# EAGLE design Display (EAGLE 7.1.0)
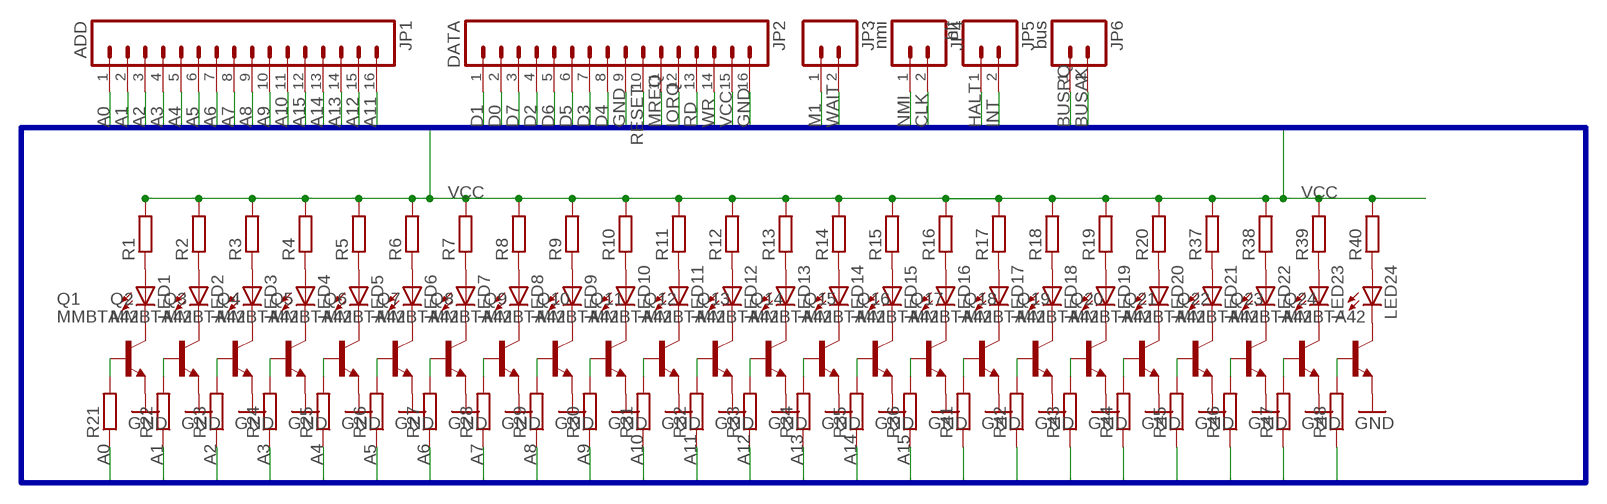
[diagram p0: schematic, sheet 1]

## Parts
JP1  ADD  M16PTH  [1X16]
JP2  DATA  M16PTH  [1X16]
JP3  M02PTH  [1X02]
JP4  nmi  M02PTH  [1X02]
JP5  hlt  M02PTH  [1X02]
JP6  bus  M02PTH  [1X02]
LED1  LEDCHIP-LED0805  [CHIP-LED0805]
LED2  LEDCHIP-LED0805  [CHIP-LED0805]
LED3  LEDCHIP-LED0805  [CHIP-LED0805]
LED4  LEDCHIP-LED0805  [CHIP-LED0805]
LED5  LEDCHIP-LED0805  [CHIP-LED0805]
LED6  LEDCHIP-LED0805  [CHIP-LED0805]
LED7  LEDCHIP-LED0805  [CHIP-LED0805]
LED8  LEDCHIP-LED0805  [CHIP-LED0805]
LED9  LEDCHIP-LED0805  [CHIP-LED0805]
LED10  LEDCHIP-LED0805  [CHIP-LED0805]
LED11  LEDCHIP-LED0805  [CHIP-LED0805]
LED12  LEDCHIP-LED0805  [CHIP-LED0805]
LED13  LEDCHIP-LED0805  [CHIP-LED0805]
LED14  LEDCHIP-LED0805  [CHIP-LED0805]
LED15  LEDCHIP-LED0805  [CHIP-LED0805]
LED16  LEDCHIP-LED0805  [CHIP-LED0805]
LED17  LEDCHIP-LED0805  [CHIP-LED0805]
LED18  LEDCHIP-LED0805  [CHIP-LED0805]
LED19  LEDCHIP-LED0805  [CHIP-LED0805]
LED20  LEDCHIP-LED0805  [CHIP-LED0805]
LED21  LEDCHIP-LED0805  [CHIP-LED0805]
LED22  LEDCHIP-LED0805  [CHIP-LED0805]
LED23  LEDCHIP-LED0805  [CHIP-LED0805]
LED24  LEDCHIP-LED0805  [CHIP-LED0805]
Q1  MMBTA42  [SOT23]
Q2  MMBTA42  [SOT23]
Q3  MMBTA42  [SOT23]
Q4  MMBTA42  [SOT23]
Q5  MMBTA42  [SOT23]
Q6  MMBTA42  [SOT23]
Q7  MMBTA42  [SOT23]
Q8  MMBTA42  [SOT23]
Q9  MMBTA42  [SOT23]
Q10  MMBTA42  [SOT23]
Q11  MMBTA42  [SOT23]
Q12  MMBTA42  [SOT23]
Q13  MMBTA42  [SOT23]
Q14  MMBTA42  [SOT23]
Q15  MMBTA42  [SOT23]
Q16  MMBTA42  [SOT23]
Q17  MMBTA42  [SOT23]
Q18  MMBTA42  [SOT23]
Q19  MMBTA42  [SOT23]
Q20  MMBTA42  [SOT23]
Q21  MMBTA42  [SOT23]
Q22  MMBTA42  [SOT23]
Q23  MMBTA42  [SOT23]
Q24  MMBTA42  [SOT23]
R1  R-EU_M0805  [M0805]
R2  R-EU_M0805  [M0805]
R3  R-EU_M0805  [M0805]
R4  R-EU_M0805  [M0805]
R5  R-EU_M0805  [M0805]
R6  R-EU_M0805  [M0805]
R7  R-EU_M0805  [M0805]
R8  R-EU_M0805  [M0805]
R9  R-EU_M0805  [M0805]
R10  R-EU_M0805  [M0805]
R11  R-EU_M0805  [M0805]
R12  R-EU_M0805  [M0805]
R13  R-EU_M0805  [M0805]
R14  R-EU_M0805  [M0805]
R15  R-EU_M0805  [M0805]
R16  R-EU_M0805  [M0805]
R17  R-EU_M0805  [M0805]
R18  R-EU_M0805  [M0805]
R19  R-EU_M0805  [M0805]
R20  R-EU_M0805  [M0805]
R21  R-EU_M0805  [M0805]
R22  R-EU_M0805  [M0805]
R23  R-EU_M0805  [M0805]
R24  R-EU_M0805  [M0805]
R25  R-EU_M0805  [M0805]
R26  R-EU_M0805  [M0805]
R27  R-EU_M0805  [M0805]
R28  R-EU_M0805  [M0805]
R29  R-EU_M0805  [M0805]
R30  R-EU_M0805  [M0805]
R31  R-EU_M0805  [M0805]
R32  R-EU_M0805  [M0805]
R33  R-EU_M0805  [M0805]
R34  R-EU_M0805  [M0805]
R35  R-EU_M0805  [M0805]
R36  R-EU_M0805  [M0805]
R37  R-EU_M0805  [M0805]
R38  R-EU_M0805  [M0805]
R39  R-EU_M0805  [M0805]
R40  R-EU_M0805  [M0805]
R41  R-EU_M0805  [M0805]
R42  R-EU_M0805  [M0805]
R43  R-EU_M0805  [M0805]
R44  R-EU_M0805  [M0805]
R45  R-EU_M0805  [M0805]
R46  R-EU_M0805  [M0805]
R47  R-EU_M0805  [M0805]
R48  R-EU_M0805  [M0805]

## Nets
A0: JP1.1 R21.1
A1: JP1.2 R22.1
A2: JP1.3 R23.1
A3: JP1.4 R24.1
A4: JP1.5 R25.1
A5: JP1.6 R26.1
A6: JP1.7 R27.1
A7: JP1.8 R28.1
A8: JP1.9 R29.1
A9: JP1.10 R30.1
A10: JP1.11 R31.1
A11: JP1.16 R32.1
A12: JP1.15 R33.1
A13: JP1.14 R34.1
A14: JP1.13 R35.1
A15: JP1.12 R36.1
BUSAK: JP6.2
BUSRQ: JP6.1
CLK: JP4.2
D0: JP2.2 R41.1
D1: JP2.1 R42.1
D2: JP2.4 R43.1
D3: JP2.7 R44.1
D4: JP2.8 R45.1
D5: JP2.6 R46.1
D6: JP2.5 R47.1
D7: JP2.3 R48.1
GND: JP2.9 JP2.16 Q1.2(E) Q2.2(E) Q3.2(E) Q4.2(E) Q5.2(E) Q6.2(E) Q7.2(E) Q8.2(E) Q9.2(E) Q10.2(E) Q11.2(E) Q12.2(E) Q13.2(E) Q14.2(E) Q15.2(E) Q16.2(E) Q17.2(E) Q18.2(E) Q19.2(E) Q20.2(E) Q21.2(E) Q22.2(E) Q23.2(E) Q24.2(E)
HALT: JP5.1
INT: JP5.2
IORQ: JP2.12
M1: JP3.1
MREQ: JP2.11
N$1: LED1.A R1.1
N$2: LED1.C Q1.3(C)
N$3: LED2.A R2.1
N$4: LED2.C Q2.3(C)
N$5: LED3.A R3.1
N$6: LED3.C Q3.3(C)
N$7: LED4.A R4.1
N$8: LED4.C Q4.3(C)
N$9: LED5.A R5.1
N$10: LED5.C Q5.3(C)
N$11: LED6.A R6.1
N$12: LED6.C Q6.3(C)
N$13: LED7.A R7.1
N$14: LED7.C Q7.3(C)
N$15: LED8.A R8.1
N$16: LED8.C Q8.3(C)
N$17: LED9.A R9.1
N$18: LED9.C Q9.3(C)
N$19: LED10.A R10.1
N$20: LED10.C Q10.3(C)
N$21: LED11.A R11.1
N$22: LED11.C Q11.3(C)
N$23: LED12.A R12.1
N$24: LED12.C Q12.3(C)
N$25: LED13.A R13.1
N$26: LED13.C Q13.3(C)
N$27: LED14.A R14.1
N$28: LED14.C Q14.3(C)
N$29: LED15.A R15.1
N$30: LED15.C Q15.3(C)
N$31: LED16.A R16.1
N$32: LED16.C Q16.3(C)
N$33: Q24.1(B) R48.2
N$34: Q23.1(B) R47.2
N$35: Q22.1(B) R46.2
N$36: Q21.1(B) R45.2
N$37: Q20.1(B) R44.2
N$38: Q19.1(B) R43.2
N$39: Q18.1(B) R42.2
N$40: Q17.1(B) R41.2
N$41: LED17.A R17.1
N$42: LED17.C Q17.3(C)
N$43: LED18.A R18.1
N$44: LED18.C Q18.3(C)
N$45: Q16.1(B) R36.2
N$46: Q15.1(B) R35.2
N$47: Q14.1(B) R34.2
N$48: Q13.1(B) R33.2
N$49: Q12.1(B) R32.2
N$50: Q11.1(B) R31.2
N$51: Q10.1(B) R30.2
N$52: Q9.1(B) R29.2
N$53: Q8.1(B) R28.2
N$54: Q7.1(B) R27.2
N$55: Q6.1(B) R26.2
N$56: Q5.1(B) R25.2
N$57: Q4.1(B) R24.2
N$58: Q3.1(B) R23.2
N$59: Q2.1(B) R22.2
N$60: Q1.1(B) R21.2
N$61: LED19.A R19.1
N$62: LED19.C Q19.3(C)
N$63: LED20.A R20.1
N$64: LED20.C Q20.3(C)
N$65: LED21.A R37.1
N$66: LED21.C Q21.3(C)
N$67: LED22.A R38.1
N$68: LED22.C Q22.3(C)
N$69: LED23.A R39.1
N$70: LED23.C Q23.3(C)
N$71: LED24.A R40.1
N$72: LED24.C Q24.3(C)
NMI: JP4.1
RD: JP2.13
RESET: JP2.10
VCC: JP2.15 R1.2 R2.2 R3.2 R4.2 R5.2 R6.2 R7.2 R8.2 R9.2 R10.2 R11.2 R12.2 R13.2 R14.2 R15.2 R16.2 R17.2 R18.2 R19.2 R20.2 R37.2 R38.2 R39.2 R40.2
WAIT: JP3.2
WR: JP2.14

## Buses
A0,A1,A2,A3,A4,A5,A6,A7,A8,A9,A10,A11,A12,A13,A14,A15,D0,D1,D2,D3,D4,D5,D6,D7,GND,VCC,WR,RD,IORQ,MREQ,RESET,M1,CLK,WAIT,NMI,HALT,INT,BUSRQ,BUSAK

## Library data of the parts
JP1 JP2 = SparkFun-Connectors:M16: 1x16 .1" header
JP3-JP6 = SparkFun:M02: Header 2 Standard 2-pin 0.1" header. Use with straight break away headers (SKU : PRT-00116), right angle break away headers (PRT-00553), swiss pins (PRT-00743), machine pins (PRT-00117), and female headers (PRT-00115). Molex polarized connector foot print use with SKU : PRT-08233 with associated crimp pins and housings.
LED1-LED24 = adafruit:LED: LED OSRAM: - CHIPLED LG R971, LG N971, LY N971, LG Q971, LY Q971, LO R971, LY R971 LH N974, LH R974 LS Q976, LO Q976, LY Q976 LO Q996 - Hyper CHIPLED LW Q18S LB Q993, LB Q99A, LB R99A - SideLED LS A670, LO A670, LY A670, LG A670, LP A670 LB A673, LV A673, LT A673, LW A673 LH A674 LY A675 LS A676, LA A676, LO A676, LY A676, LW A676 LS A679, LY A679, LG A679 - Hyper Micro SIDELED® LS Y876, LA Y876, LO Y876, LY Y876 LT Y87S - SmartLED LW L88C, LW L88S LB L89C, LB L89S, LG L890 LS L89K, LO L89K, LY L89K LS L896, LA L896, LO L896, LY L896 - TOPLED LS T670, LO T670, LY T670, LG T670, LP T670 LSG T670, LSP T670, LSY T670, LOP T670, LYG T670 LG T671, LOG T671, LSG T671 LB T673, LV T673, LT T673, LW T673 LH T674 LS T676, LA T676, LO T676, LY T676, LB T676, LH T676, LSB T676, LW T676 LB T67C, LV T67C, LT T67C, LS T67K, LO T67K, LY T67K, LW E67C LS E67B, LA E67B, LO E67B, LY E67B, LB E67C, LV E67C, LT E67C LW T67C LS T679, LY T679, LG T679 LS T770, LO T770, LY T770, LG T770, LP T770 LB T773, LV T773, LT T773, LW T773 LH T774 LS E675, LA E675, LY E675, LS T675 LS T776, LA T776, LO T776, LY T776, LB T776 LHGB T686 LT T68C, LB T68C - Hyper Mini TOPLED® LB M676 - Mini TOPLED Santana® LG M470 LS M47K, LO M47K, LY M47K Source: http://www.osram.convergy.de/
Q1-Q24 = transistor-npn:MMBTA42: NPN TRANSISTOR
R1-R48 = rcl:R-EU_: RESISTOR, European symbol

## Board
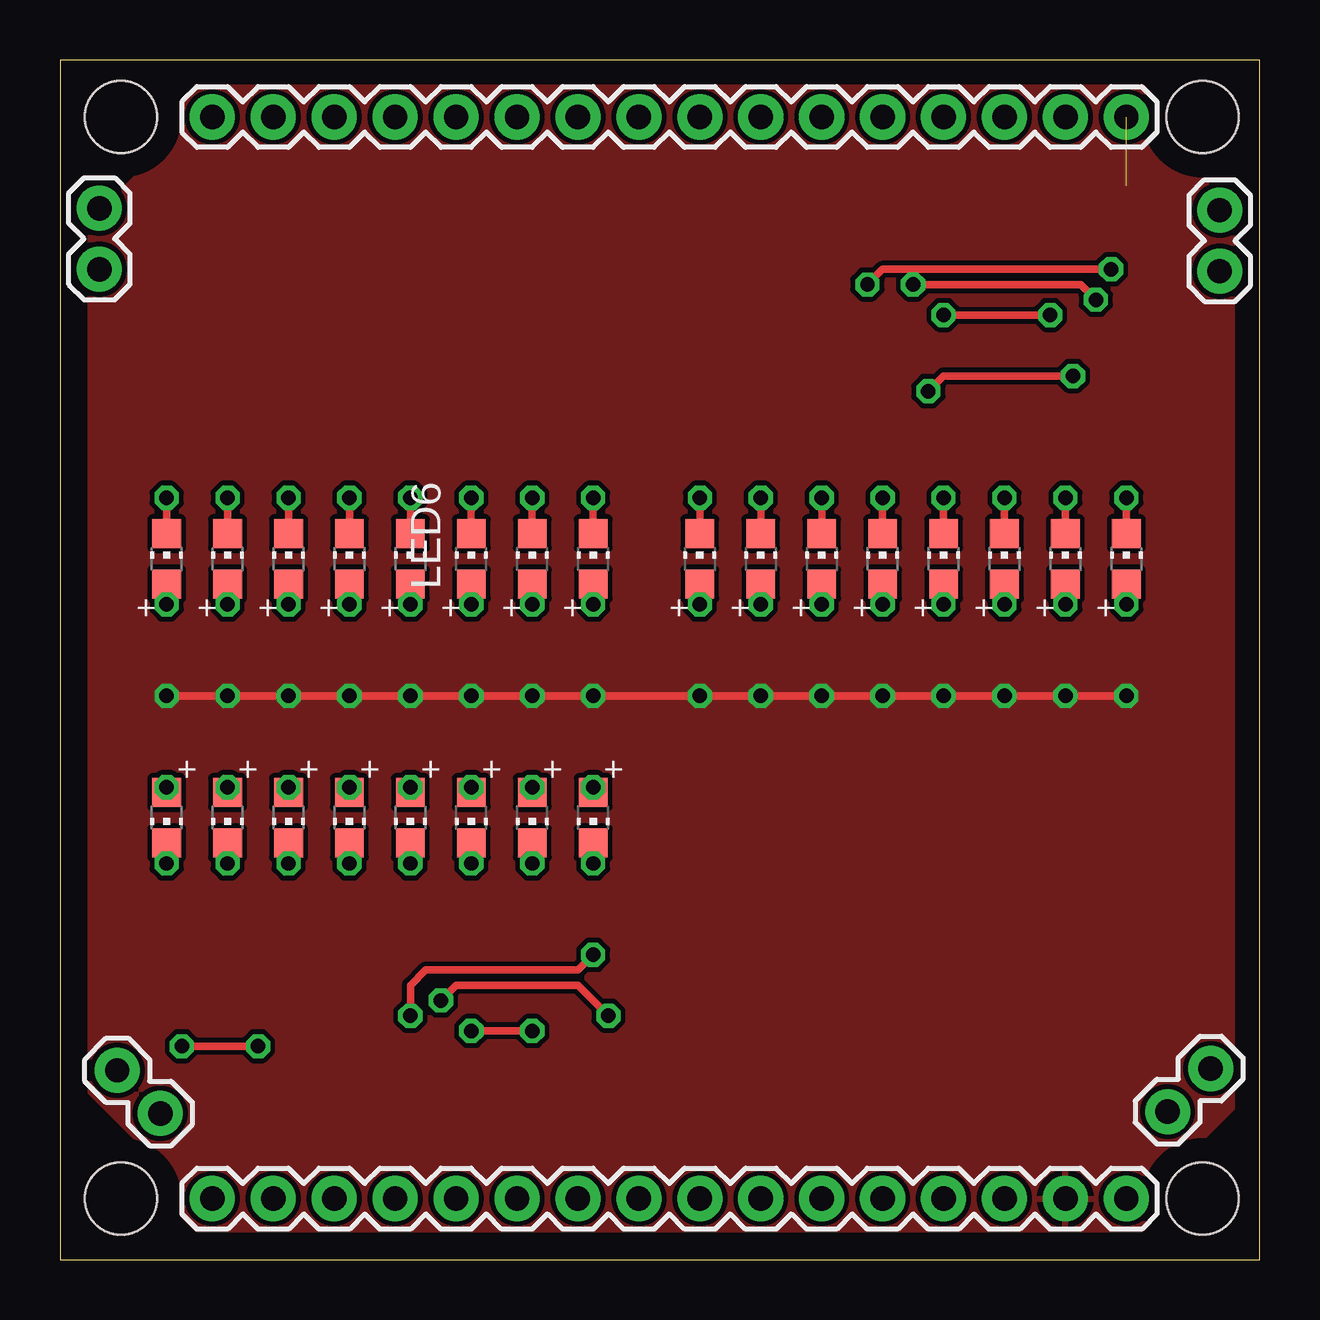
[diagram p1: board, top side]
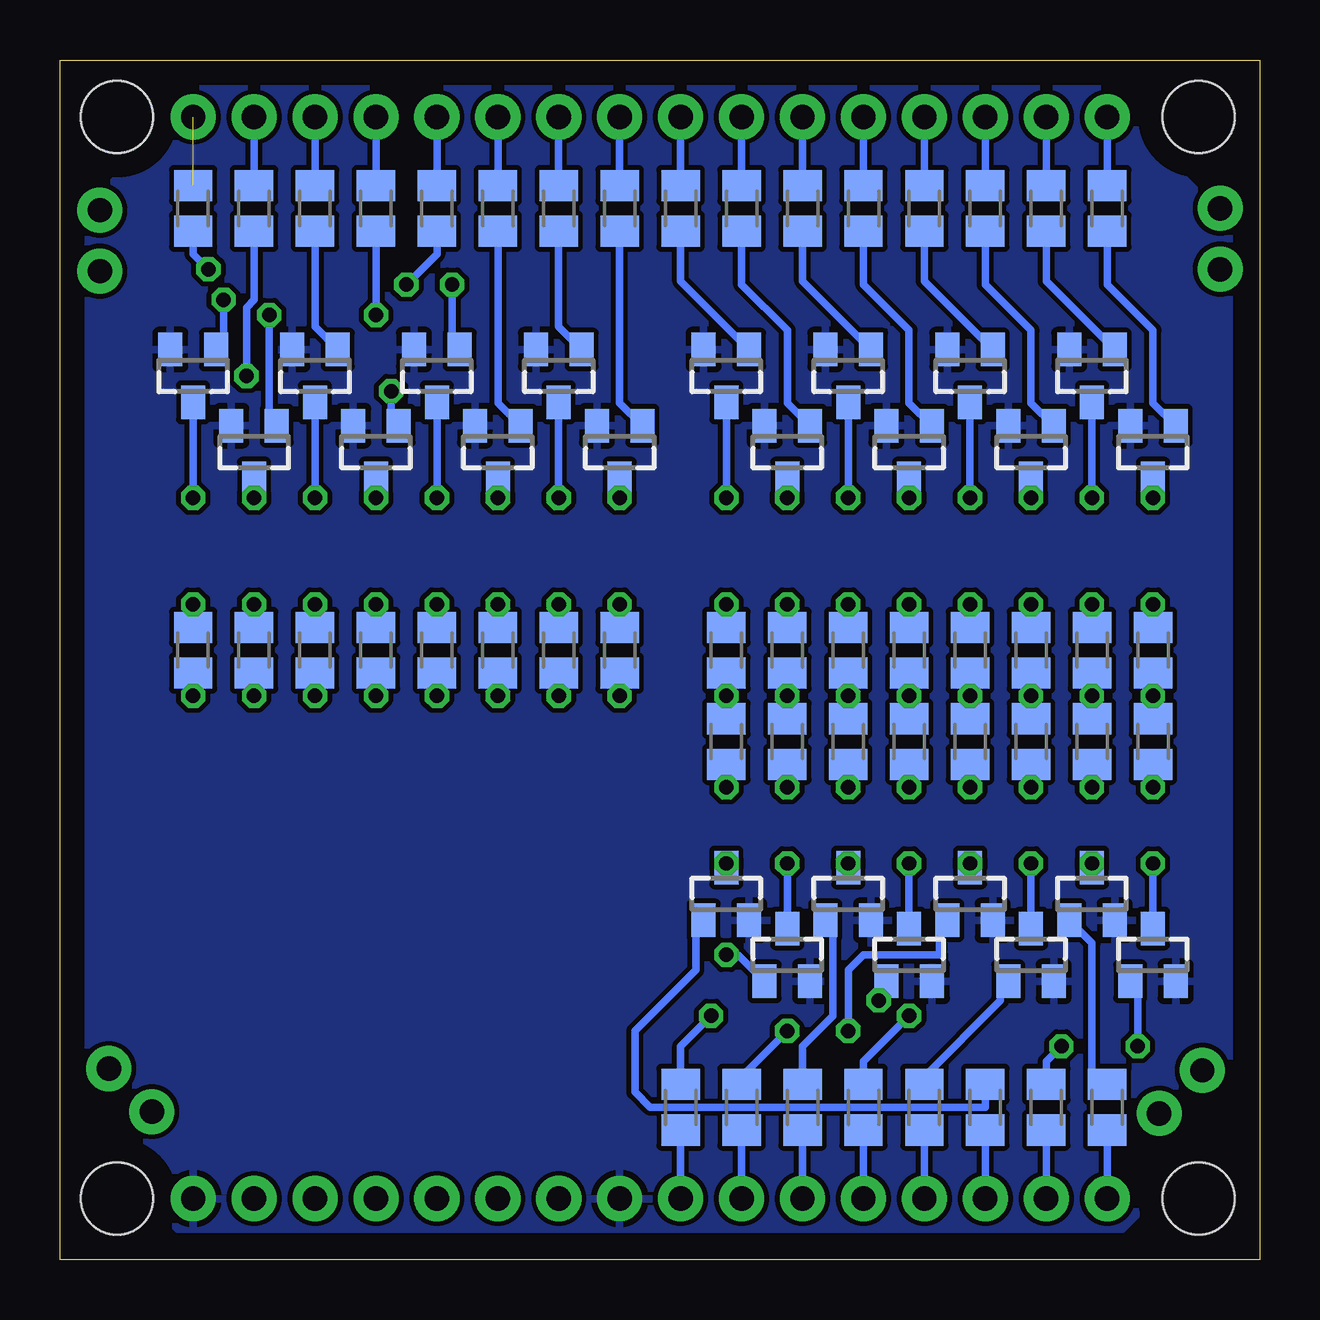
[diagram p2: board, bottom side, seen from below]

Size 50 x 50 mm. Coordinates in mm from the lower left corner, seen from the top.
Outline: 0,0 50,0 50,50 0,50 0,0
Copper layers (1*16): Top 0.035mm / dielectric 1.5mm / Bottom 0.035mm
Design rules "default": minimum track width 10mil, minimum drill 24mil, track to track 8mil, track to pad 8mil, pad to pad 8mil, via to via 8mil, smd to smd 8mil, copper to edge 40mil, drill to drill 8mil, minimum pad ring 10mil, minimum via ring 8mil, stop-mask expansion 4mil, vias tented up to drill 0mil, thermal gap 10mil
Holes 3 mm at 2.54,47.62 47.62,47.62 47.62,2.54 2.54,2.54

### Footprints (pad centres in the part's own frame; a part is rotated, then mirrored left to right if it is on the bottom)
1X16 = drill 1.016 pad 1.88: 1 0,0; 2 2.54,0; 3 5.08,0; 4 7.62,0; 5 10.16,0; 6 12.7,0; 7 15.24,0; 8 17.78,0; 9 20.32,0; 10 22.86,0; 11 25.4,0; 12 27.94,0; 13 30.48,0; 14 33.02,0; 15 35.56,0; 16 38.1,0
1X02 = drill 1.016 pad 1.88: 1 0,0; 2 2.54,0
CHIP-LED0805 = smd 1.2 x 1.2: A 0,-1.05; C 0,1.05
SOT23 = smd 1 x 1.4: 1 -0.95,-1.1; 2 0.95,-1.1; 3 0,1.1
M0805 = smd 1.3 x 1.6: 1 -0.95,0; 2 0.95,0

### Placement (x,y rotation side)
JP1  6.35,47.62 0 top
JP2  6.35,2.54 0 top
JP3  4.18,6.09 135 top
JP4  46.17,6.16 45 top
JP5  1.64,41.27 90 top
JP6  48.34,41.2 90 top
LED1  4.45,29.21 0 top
LED2  6.99,29.21 0 top
LED3  9.53,29.21 0 top
LED4  12.06,29.21 0 top
LED5  14.61,29.21 0 top
LED6  17.14,29.21 0 top
LED7  19.68,29.21 0 top
LED8  22.23,29.21 0 top
LED9  26.67,29.21 0 top
LED10  29.21,29.21 0 top
LED11  31.75,29.21 0 top
LED12  34.29,29.21 0 top
LED13  36.83,29.21 0 top
LED14  39.37,29.21 0 top
LED15  41.91,29.21 0 top
LED16  44.45,29.21 0 top
LED17  4.45,18.41 180 top
LED18  6.99,18.41 180 top
LED19  9.53,18.41 180 top
LED20  12.06,18.41 180 top
LED21  14.61,18.41 180 top
LED22  17.14,18.41 180 top
LED23  19.68,18.41 180 top
LED24  22.23,18.41 180 top
Q1  4.45,33.66 180 bottom
Q2  6.99,36.83 180 bottom
Q3  9.53,33.66 180 bottom
Q4  12.06,36.83 180 bottom
Q5  14.61,33.66 180 bottom
Q6  17.14,36.83 180 bottom
Q7  19.68,33.66 180 bottom
Q8  22.23,36.83 180 bottom
Q9  26.67,33.66 180 bottom
Q10  29.21,36.83 180 bottom
Q11  31.75,33.66 180 bottom
Q12  34.29,36.83 180 bottom
Q13  36.83,33.66 180 bottom
Q14  39.37,36.83 180 bottom
Q15  41.91,33.66 180 bottom
Q16  44.45,36.83 180 bottom
Q17  4.45,12.7 0 bottom
Q18  6.99,15.24 0 bottom
Q19  9.53,12.7 0 bottom
Q20  12.06,15.24 0 bottom
Q21  14.61,12.7 0 bottom
Q22  17.14,15.24 0 bottom
Q23  19.68,12.7 0 bottom
Q24  22.23,15.24 0 bottom
R1  4.45,25.4 270 bottom
R2  6.99,25.4 270 bottom
R3  9.53,25.4 270 bottom
R4  12.06,25.4 270 bottom
R5  14.61,25.4 270 bottom
R6  17.14,25.4 270 bottom
R7  19.68,25.4 270 bottom
R8  22.23,25.4 270 bottom
R9  26.67,25.4 270 bottom
R10  29.21,25.4 270 bottom
R11  31.75,25.4 270 bottom
R12  34.29,25.4 270 bottom
R13  36.83,25.4 270 bottom
R14  39.37,25.4 270 bottom
R15  41.91,25.4 270 bottom
R16  44.45,25.4 270 bottom
R17  4.45,21.59 90 bottom
R18  6.99,21.59 90 bottom
R19  9.53,21.59 90 bottom
R20  12.06,21.59 90 bottom
R21  6.35,43.81 270 bottom
R22  8.89,43.81 270 bottom
R23  11.43,43.81 270 bottom
R24  13.97,43.81 270 bottom
R25  16.51,43.81 270 bottom
R26  19.05,43.81 270 bottom
R27  21.59,43.81 270 bottom
R28  24.13,43.81 270 bottom
R29  26.67,43.81 270 bottom
R30  29.21,43.81 270 bottom
R31  31.75,43.81 270 bottom
R32  44.45,43.81 270 bottom
R33  41.91,43.81 270 bottom
R34  39.37,43.81 270 bottom
R35  36.83,43.81 270 bottom
R36  34.29,43.81 270 bottom
R37  14.61,21.59 90 bottom
R38  17.14,21.59 90 bottom
R39  19.68,21.59 90 bottom
R40  22.23,21.59 90 bottom
R41  8.89,6.35 90 bottom
R42  6.35,6.35 90 bottom
R43  13.97,6.35 90 bottom
R44  21.59,6.35 90 bottom
R45  24.13,6.35 90 bottom
R46  19.05,6.35 90 bottom
R47  16.51,6.35 90 bottom
R48  11.43,6.35 90 bottom

### Tracks (layer width: path | path; a pad name or v marks a point on that pad's centre or on a via)
A0
  Bottom 0.305: R21.1 JP1.1
A1
  Bottom 0.305: R22.1 JP1.2
A2
  Bottom 0.305: R23.1 JP1.3
A3
  Bottom 0.305: R24.1 JP1.4
A4
  Bottom 0.305: R25.1 JP1.5
A5
  Bottom 0.305: R26.1 JP1.6
A6
  Bottom 0.305: R27.1 JP1.7
A7
  Bottom 0.305: R28.1 JP1.8
A8
  Bottom 0.305: R29.1 JP1.9
A9
  Bottom 0.305: R30.1 JP1.10
A10
  Bottom 0.305: R31.1 JP1.11
A11  (1 unrouted)
A12
  Bottom 0.305: R33.1 JP1.15
A13
  Bottom 0.305: R34.1 JP1.14
A14
  Bottom 0.305: R35.1 JP1.13
A15
  Bottom 0.305: R36.1 JP1.12
D0
  Bottom 0.305: JP2.2 R41.1
D1
  Bottom 0.305: JP2.1 R42.1
D2
  Bottom 0.305: JP2.4 R43.1
D3
  Bottom 0.305: JP2.7 R44.1
D4
  Bottom 0.305: JP2.8 R45.1
D5
  Bottom 0.305: JP2.6 R46.1
D6
  Bottom 0.305: JP2.5 R47.1
D7
  Bottom 0.305: JP2.3 R48.1
GND
  pour Bottom: 1.27,6.99 5.08,3.17 5.08,1.91 5.71,1.27 45.09,1.27 45.72,1.91 45.72,3.17 48.9,6.35 48.9,43.81 45.72,46.99 45.72,48.26 45.09,48.9 5.71,48.9 5.08,48.26 5.08,46.99 1.27,43.18
N$1  (via drill 0.6)
  Top 0.305: LED1.A v4.45,27.3
  Bottom 0.305: v4.45,27.3 R1.1
N$2  (via drill 0.6)
  Top 0.305: LED1.C v4.45,31.75
  Bottom 0.305: v4.45,31.75 Q1.3
N$3  (via drill 0.6)
  Top 0.305: LED2.A v6.99,27.3
  Bottom 0.305: v6.99,27.3 R2.1
N$4  (via drill 0.6)
  Top 0.305: LED2.C v6.99,31.75
  Bottom 0.305: v6.99,31.75 Q2.3
N$5  (via drill 0.6)
  Top 0.305: LED3.A v9.53,27.3
  Bottom 0.305: v9.53,27.3 R3.1
N$6  (via drill 0.6)
  Top 0.305: LED3.C v9.53,31.75
  Bottom 0.305: v9.53,31.75 Q3.3
N$7  (via drill 0.6)
  Top 0.305: LED4.A v12.06,27.3
  Bottom 0.305: v12.06,27.3 R4.1
N$8  (via drill 0.6)
  Top 0.305: LED4.C v12.06,31.75
  Bottom 0.305: v12.06,31.75 Q4.3
N$9  (via drill 0.6)
  Top 0.305: LED5.A v14.61,27.3
  Bottom 0.305: v14.61,27.3 R5.1
N$10  (via drill 0.6)
  Top 0.305: LED5.C v14.61,31.75
  Bottom 0.305: v14.61,31.75 Q5.3
N$11  (via drill 0.6)
  Top 0.305: LED6.A v17.14,27.3
  Bottom 0.305: v17.14,27.3 R6.1
N$12  (via drill 0.6)
  Top 0.305: LED6.C v17.14,31.75
  Bottom 0.305: v17.14,31.75 Q6.3
N$13  (via drill 0.6)
  Top 0.305: LED7.A v19.68,27.3
  Bottom 0.305: v19.68,27.3 R7.1
N$14  (via drill 0.6)
  Top 0.305: LED7.C v19.68,31.75
  Bottom 0.305: v19.68,31.75 Q7.3
N$15  (via drill 0.6)
  Top 0.305: LED8.A v22.23,27.3
  Bottom 0.305: v22.23,27.3 R8.1
N$16  (via drill 0.6)
  Top 0.305: LED8.C v22.23,31.75
  Bottom 0.305: v22.23,31.75 Q8.3
N$17  (via drill 0.6)
  Top 0.305: LED9.A v26.67,27.3
  Bottom 0.305: v26.67,27.3 R9.1
N$18  (via drill 0.6)
  Top 0.305: LED9.C v26.67,31.75
  Bottom 0.305: v26.67,31.75 Q9.3
N$19  (via drill 0.6)
  Top 0.305: LED10.A v29.21,27.3
  Bottom 0.305: v29.21,27.3 R10.1
N$20  (via drill 0.6)
  Top 0.305: LED10.C v29.21,31.75
  Bottom 0.305: v29.21,31.75 Q10.3
N$21  (via drill 0.6)
  Top 0.305: LED11.A v31.75,27.3
  Bottom 0.305: v31.75,27.3 R11.1
N$22  (via drill 0.6)
  Top 0.305: LED11.C v31.75,31.75
  Bottom 0.305: v31.75,31.75 Q11.3
N$23  (via drill 0.6)
  Top 0.305: LED12.A v34.29,27.3
  Bottom 0.305: v34.29,27.3 R12.1
N$24  (via drill 0.6)
  Top 0.305: LED12.C v34.29,31.75
  Bottom 0.305: v34.29,31.75 Q12.3
N$25  (via drill 0.6)
  Top 0.305: LED13.A v36.83,27.3
  Bottom 0.305: v36.83,27.3 R13.1
N$26  (via drill 0.6)
  Top 0.305: LED13.C v36.83,31.75
  Bottom 0.305: v36.83,31.75 Q13.3
N$27  (via drill 0.6)
  Top 0.305: LED14.A v39.37,27.3
  Bottom 0.305: v39.37,27.3 R14.1
N$28  (via drill 0.6)
  Top 0.305: LED14.C v39.37,31.75
  Bottom 0.305: v39.37,31.75 Q14.3
N$29  (via drill 0.6)
  Top 0.305: LED15.A v41.91,27.3
  Bottom 0.305: v41.91,27.3 R15.1
N$30  (via drill 0.6)
  Top 0.305: LED15.C v41.91,31.75
  Bottom 0.305: v41.91,31.75 Q15.3
N$31  (via drill 0.6)
  Top 0.305: LED16.A v44.45,27.3
  Bottom 0.305: v44.45,27.3 R16.1
N$32  (via drill 0.6)
  Top 0.305: LED16.C v44.45,31.75
  Bottom 0.305: v44.45,31.75 Q16.3
N$33
  Bottom 0.305: R48.2 11.43,6.35 25.4,6.35 26.04,6.99 26.04,9.53 23.5,12.06 23.5,13.82 Q24.1
N$34  (via drill 0.6)
  Top 0.305: v14.61,10.16 14.61,11.43 15.24,12.06 21.59,12.06 v22.23,12.7
  Bottom 0.305: R47.2 16.51,8.26 v14.61,10.16 | v22.23,12.7 21.73,12.7 Q23.1
N$35
  Bottom 0.305: R46.2 19.05,8.89 17.78,10.16 17.78,13.82 Q22.1
N$36  (via drill 0.6)
  Top 0.305: v22.86,10.16 21.59,11.43 16.51,11.43 v15.88,10.79
  Bottom 0.305: R45.2 24.13,8.89 v22.86,10.16 | v15.88,10.79 15.88,11.28 Q21.1
N$37  (via drill 0.6)
  Top 0.305: v19.68,9.53 v17.14,9.53
  Bottom 0.305: R44.2 21.59,7.62 v19.68,9.53 | v17.14,9.53 17.14,12.06 16.51,12.7 13.34,12.7 13.34,13.82 Q20.1
N$38
  Bottom 0.305: R43.2 13.97,7.62 10.79,10.79 10.79,11.28 Q19.1
N$39
  Bottom 0.305: R42.2 arc90 6.99,7.93 6.99,13.19 Q18.1
N$40  (via drill 0.6)
  Top 0.305: v8.26,8.89 v5.08,8.89
  Bottom 0.305: R41.2 8.89,8.26 v8.26,8.89 | v5.08,8.89 5.08,11.29 Q17.1
N$41  (via drill 0.6)
  Top 0.305: LED17.A v4.45,19.68
  Bottom 0.305: v4.45,19.68 R17.1
N$42  (via drill 0.6)
  Top 0.305: LED17.C v4.45,16.51
  Bottom 0.305: v4.45,16.51 Q17.3
N$43  (via drill 0.6)
  Top 0.305: LED18.A v6.99,19.68
  Bottom 0.305: v6.99,19.68 R18.1
N$44  (via drill 0.6)
  Top 0.305: LED18.C v6.99,16.51
  Bottom 0.305: v6.99,16.51 Q18.3
N$45  (via drill 0.6)
  Top 0.305: v35.56,40.64 42.55,40.64 v43.18,40.01
  Bottom 0.305: R36.2 34.29,41.91 v35.56,40.64 | v43.18,40.01 43.18,38.25 Q16.1
N$46  (via drill 0.6)
  Top 0.305: v36.83,39.37 v41.27,39.37
  Bottom 0.305: R35.2 v36.83,39.37 | v41.27,39.37 41.27,35.07 Q15.1
N$47
  Bottom 0.305: R34.2 39.37,38.88 Q14.1
N$48  (via drill 0.6)
  Top 0.305: v42.23,36.83 36.83,36.83 v36.2,36.2
  Bottom 0.305: R33.2 41.91,40.01 42.23,39.69 v42.23,36.83 | v36.2,36.2 36.2,35.07 Q13.1
N$49  (via drill 0.6)
  Top 0.305: v43.81,41.27 34.29,41.27 v33.66,40.64
  Bottom 0.305: R32.2 44.45,41.91 v43.81,41.27 | v33.66,40.64 33.66,38.24 Q12.1
N$50
  Bottom 0.305: Q11.1 31.75,35.7 R31.2
N$51
  Bottom 0.305: Q10.1 29.21,38.88 R30.2
N$52
  Bottom 0.305: Q9.1 26.67,35.7 R29.2
N$53
  Bottom 0.305: Q8.1 24.13,40.78 R28.2
N$54
  Bottom 0.305: Q7.1 19.68,35.7 19.68,38.73 21.59,40.64 R27.2
N$55
  Bottom 0.305: Q6.1 19.05,40.78 R26.2
N$56
  Bottom 0.305: Q5.1 14.61,35.7 14.61,38.73 16.51,40.64 R25.2
N$57
  Bottom 0.305: Q4.1 13.97,40.78 R24.2
N$58
  Bottom 0.305: Q3.1 9.53,35.7 9.53,38.73 11.43,40.64 R23.2
N$59
  Bottom 0.305: Q2.1 8.89,40.78 R22.2
N$60
  Bottom 0.305: Q1.1 4.45,35.7 4.45,38.73 6.35,40.64 R21.2
N$61  (via drill 0.6)
  Top 0.305: LED19.A v9.53,19.68
  Bottom 0.305: v9.53,19.68 R19.1
N$62  (via drill 0.6)
  Top 0.305: LED19.C v9.53,16.51
  Bottom 0.305: v9.53,16.51 Q19.3
N$63  (via drill 0.6)
  Top 0.305: LED20.A v12.06,19.68
  Bottom 0.305: v12.06,19.68 R20.1
N$64  (via drill 0.6)
  Top 0.305: LED20.C v12.06,16.51
  Bottom 0.305: v12.06,16.51 Q20.3
N$65  (via drill 0.6)
  Top 0.305: LED21.A v14.61,19.68
  Bottom 0.305: v14.61,19.68 R37.1
N$66  (via drill 0.6)
  Top 0.305: LED21.C v14.61,16.51
  Bottom 0.305: v14.61,16.51 Q21.3
N$67  (via drill 0.6)
  Top 0.305: LED22.A v17.14,19.68
  Bottom 0.305: v17.14,19.68 R38.1
N$68  (via drill 0.6)
  Top 0.305: LED22.C v17.14,16.51
  Bottom 0.305: v17.14,16.51 Q22.3
N$69  (via drill 0.6)
  Top 0.305: LED23.A v19.68,19.68
  Bottom 0.305: v19.68,19.68 R39.1
N$70  (via drill 0.6)
  Top 0.305: LED23.C v19.68,16.51
  Bottom 0.305: v19.68,16.51 Q23.3
N$71  (via drill 0.6)
  Top 0.305: LED24.A v22.23,19.68
  Bottom 0.305: v22.23,19.68 R40.1
N$72  (via drill 0.6)
  Top 0.305: LED24.C v22.23,16.51
  Bottom 0.305: v22.23,16.51 Q24.3
VCC  (via drill 0.6)
  Top 0.305: v4.45,23.5 v6.99,23.5 v9.53,23.5 v12.06,23.5 v14.61,23.5 v17.14,23.5 v19.68,23.5 v22.23,23.5 v26.67,23.5 v29.21,23.5 31.11,23.5 v31.75,23.5 v34.29,23.5 v36.83,23.5 v39.37,23.5 v41.91,23.5 v44.45,23.5
  Bottom 0.305: R17.2 v4.45,23.5 R1.2 | R18.2 v6.99,23.5 R2.2 | R19.2 v9.53,23.5 R3.2 | R20.2 v12.06,23.5 R4.2 | R37.2 v14.61,23.5 R5.2 | R38.2 v17.14,23.5 R6.2 | R39.2 v19.68,23.5 R7.2 | R40.2 v22.23,23.5 R8.2 | R9.2 v26.67,23.5 | R10.2 v29.21,23.5 | R16.2 v44.45,23.5 | R15.2 v41.91,23.5 | R14.2 v39.37,23.5 | R13.2 v36.83,23.5 | R12.2 v34.29,23.5 | R11.2 v31.75,23.5
  pour Top: 1.27,6.99 5.08,3.17 5.08,1.91 5.71,1.27 45.09,1.27 45.72,1.91 45.72,3.17 48.9,6.35 48.9,43.81 45.72,46.99 45.72,48.26 45.09,48.9 5.71,48.9 5.08,48.26 5.08,46.99 1.27,43.18